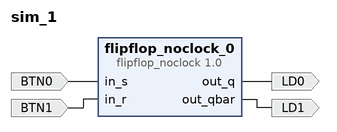
[diagram p0: block diagram of the top level]
# Vivado block design sim_1, xc7z010clg400-1, Vivado 2017.2
create_bd_design sim_1

create_bd_port -dir I BTN0
create_bd_port -dir I BTN1
create_bd_port -dir O LD0
create_bd_port -dir O LD1

create_bd_cell -type ip -vlnv episource.de:user:flipflop_noclock:1.0 flipflop_noclock_0

# ---- connections ----

connect_bd_net -net BTN0_1 [get_bd_ports BTN0] [get_bd_pins flipflop_noclock_0/in_s]
connect_bd_net -net BTN1_1 [get_bd_ports BTN1] [get_bd_pins flipflop_noclock_0/in_r]
connect_bd_net [get_bd_pins flipflop_noclock_0/out_q] [get_bd_ports LD0]
connect_bd_net [get_bd_pins flipflop_noclock_0/out_qbar] [get_bd_ports LD1]

validate_bd_design
save_bd_design
